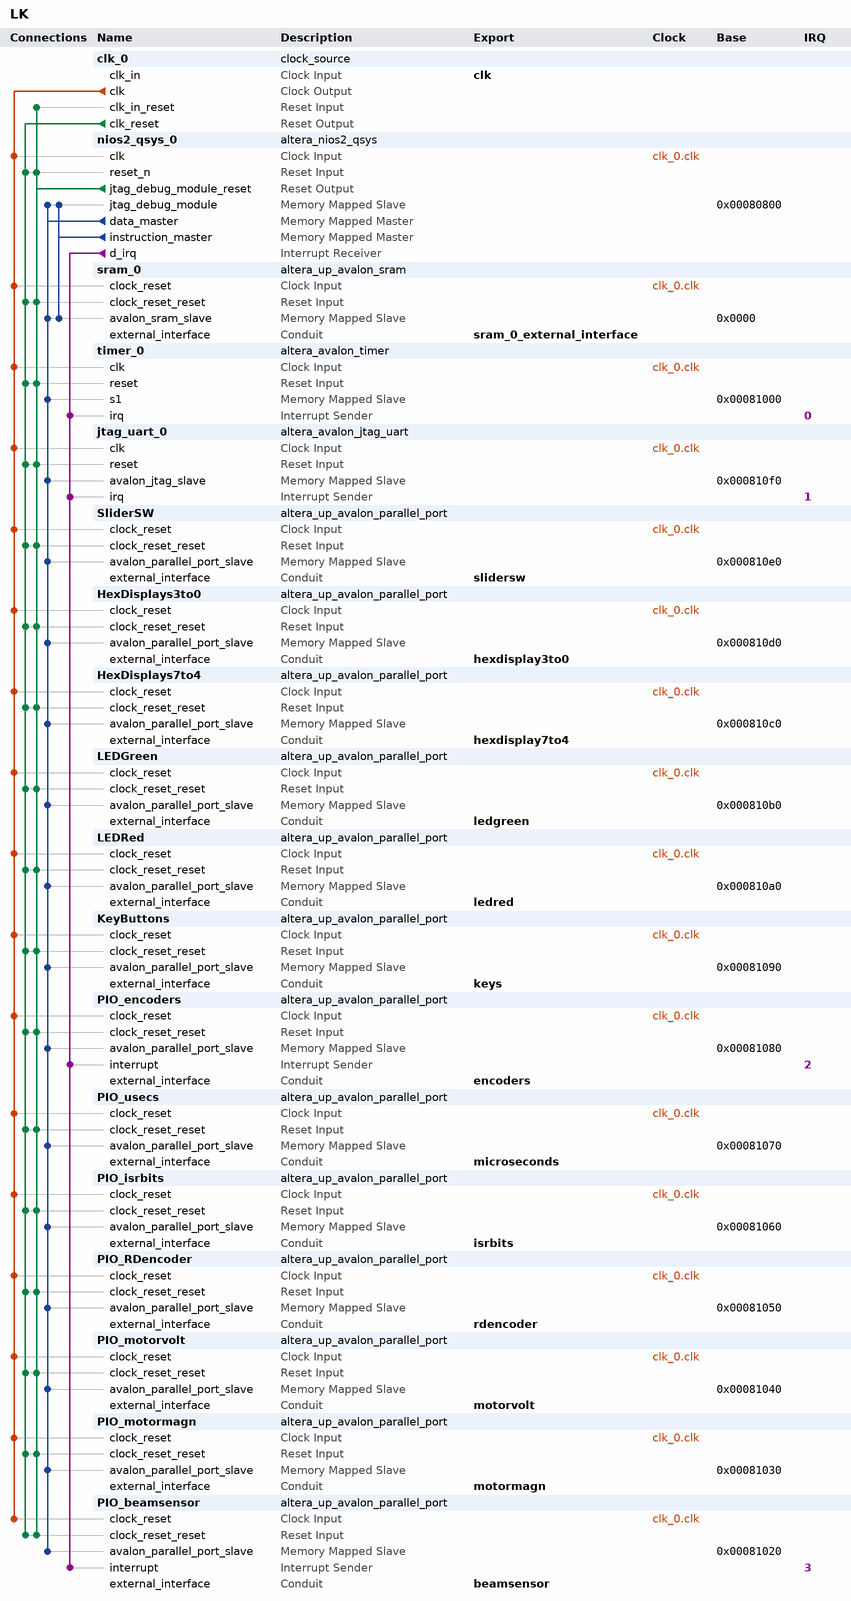
[diagram p0: system contents]
# Platform Designer (Qsys) system LK, Cyclone II EP2C35F672C6
# Parameters at their usual value, and those the tool derives, are not listed.
package require -exact qsys 13.0
create_system LK
set_project_property DEVICE_FAMILY {Cyclone II}
set_project_property DEVICE EP2C35F672C6

add_instance clk_0 clock_source 13.0
set_instance_parameter_value clk_0 clockFrequency 50000000

add_instance nios2_qsys_0 altera_nios2_qsys 13.0
set_instance_parameter_value nios2_qsys_0 resetSlave sram_0.avalon_sram_slave
set_instance_parameter_value nios2_qsys_0 mmu_TLBMissExcSlave None
set_instance_parameter_value nios2_qsys_0 exceptionSlave sram_0.avalon_sram_slave
set_instance_parameter_value nios2_qsys_0 breakSlave nios2_qsys_0.jtag_debug_module
set_instance_parameter_value nios2_qsys_0 impl Fast
set_instance_parameter_value nios2_qsys_0 icache_size 4096

add_instance sram_0 altera_up_avalon_sram 13.0
set_instance_parameter_value sram_0 board DE2
set_instance_parameter_value sram_0 pixel_buffer false

add_instance timer_0 altera_avalon_timer 13.0.1.99.2
set_instance_parameter_value timer_0 period 1
set_instance_parameter_value timer_0 periodUnits MSEC

add_instance jtag_uart_0 altera_avalon_jtag_uart 13.0.1.99.2
set_instance_parameter_value jtag_uart_0 simInteractiveOptions NO_INTERACTIVE_WINDOWS

add_instance SliderSW altera_up_avalon_parallel_port 13.0
set_instance_parameter_value SliderSW board DE2
set_instance_parameter_value SliderSW preset {Slider Switches}
set_instance_parameter_value SliderSW capture false
set_instance_parameter_value SliderSW edge Rising
set_instance_parameter_value SliderSW irq false

add_instance HexDisplays3to0 altera_up_avalon_parallel_port 13.0
set_instance_parameter_value HexDisplays3to0 board DE2
set_instance_parameter_value HexDisplays3to0 preset {Seven Segment Displays}
set_instance_parameter_value HexDisplays3to0 capture false
set_instance_parameter_value HexDisplays3to0 edge Rising
set_instance_parameter_value HexDisplays3to0 irq false

add_instance HexDisplays7to4 altera_up_avalon_parallel_port 13.0
set_instance_parameter_value HexDisplays7to4 board DE2
set_instance_parameter_value HexDisplays7to4 preset {Seven Segment Displays}
set_instance_parameter_value HexDisplays7to4 sevensegs {7 to 4}
set_instance_parameter_value HexDisplays7to4 capture false
set_instance_parameter_value HexDisplays7to4 edge Rising
set_instance_parameter_value HexDisplays7to4 irq false

add_instance LEDGreen altera_up_avalon_parallel_port 13.0
set_instance_parameter_value LEDGreen board DE2
set_instance_parameter_value LEDGreen preset LEDs
set_instance_parameter_value LEDGreen capture false
set_instance_parameter_value LEDGreen edge Rising
set_instance_parameter_value LEDGreen irq false

add_instance LEDRed altera_up_avalon_parallel_port 13.0
set_instance_parameter_value LEDRed board DE2
set_instance_parameter_value LEDRed preset LEDs
set_instance_parameter_value LEDRed leds Red
set_instance_parameter_value LEDRed capture false
set_instance_parameter_value LEDRed edge Rising
set_instance_parameter_value LEDRed irq false

add_instance KeyButtons altera_up_avalon_parallel_port 13.0
set_instance_parameter_value KeyButtons board DE2
set_instance_parameter_value KeyButtons preset Pushbuttons
set_instance_parameter_value KeyButtons capture false
set_instance_parameter_value KeyButtons edge Rising
set_instance_parameter_value KeyButtons irq false

add_instance PIO_encoders altera_up_avalon_parallel_port 13.0
set_instance_parameter_value PIO_encoders board DE2
set_instance_parameter_value PIO_encoders custom_port true
set_instance_parameter_value PIO_encoders preset Pushbuttons
set_instance_parameter_value PIO_encoders capture true
set_instance_parameter_value PIO_encoders edge Either
set_instance_parameter_value PIO_encoders irq true

add_instance PIO_usecs altera_up_avalon_parallel_port 13.0
set_instance_parameter_value PIO_usecs board DE2
set_instance_parameter_value PIO_usecs custom_port true
set_instance_parameter_value PIO_usecs preset Pushbuttons
set_instance_parameter_value PIO_usecs capture false
set_instance_parameter_value PIO_usecs edge Rising
set_instance_parameter_value PIO_usecs irq false

add_instance PIO_isrbits altera_up_avalon_parallel_port 13.0
set_instance_parameter_value PIO_isrbits board DE2
set_instance_parameter_value PIO_isrbits custom_port true
set_instance_parameter_value PIO_isrbits preset Pushbuttons
set_instance_parameter_value PIO_isrbits capture false
set_instance_parameter_value PIO_isrbits edge Rising
set_instance_parameter_value PIO_isrbits irq false

add_instance PIO_RDencoder altera_up_avalon_parallel_port 13.0
set_instance_parameter_value PIO_RDencoder board DE2
set_instance_parameter_value PIO_RDencoder custom_port true
set_instance_parameter_value PIO_RDencoder preset Pushbuttons
set_instance_parameter_value PIO_RDencoder capture false
set_instance_parameter_value PIO_RDencoder edge Rising
set_instance_parameter_value PIO_RDencoder irq false

add_instance PIO_motorvolt altera_up_avalon_parallel_port 13.0
set_instance_parameter_value PIO_motorvolt board DE2
set_instance_parameter_value PIO_motorvolt custom_port true
set_instance_parameter_value PIO_motorvolt preset Pushbuttons
set_instance_parameter_value PIO_motorvolt capture false
set_instance_parameter_value PIO_motorvolt edge Rising
set_instance_parameter_value PIO_motorvolt irq false

add_instance PIO_motormagn altera_up_avalon_parallel_port 13.0
set_instance_parameter_value PIO_motormagn board DE2
set_instance_parameter_value PIO_motormagn custom_port true
set_instance_parameter_value PIO_motormagn preset Pushbuttons
set_instance_parameter_value PIO_motormagn capture false
set_instance_parameter_value PIO_motormagn edge Rising
set_instance_parameter_value PIO_motormagn irq false

add_instance PIO_beamsensor altera_up_avalon_parallel_port 13.0
set_instance_parameter_value PIO_beamsensor board DE2
set_instance_parameter_value PIO_beamsensor custom_port true
set_instance_parameter_value PIO_beamsensor preset Pushbuttons
set_instance_parameter_value PIO_beamsensor capture true
set_instance_parameter_value PIO_beamsensor edge Either
set_instance_parameter_value PIO_beamsensor irq true

# connections
add_connection clk_0.clk HexDisplays3to0.clock_reset clock
add_connection clk_0.clk HexDisplays7to4.clock_reset clock
add_connection clk_0.clk jtag_uart_0.clk clock
add_connection clk_0.clk KeyButtons.clock_reset clock
add_connection clk_0.clk LEDGreen.clock_reset clock
add_connection clk_0.clk LEDRed.clock_reset clock
add_connection clk_0.clk nios2_qsys_0.clk clock
add_connection clk_0.clk PIO_beamsensor.clock_reset clock
add_connection clk_0.clk PIO_encoders.clock_reset clock
add_connection clk_0.clk PIO_isrbits.clock_reset clock
add_connection clk_0.clk PIO_motormagn.clock_reset clock
add_connection clk_0.clk PIO_motorvolt.clock_reset clock
add_connection clk_0.clk PIO_RDencoder.clock_reset clock
add_connection clk_0.clk PIO_usecs.clock_reset clock
add_connection clk_0.clk SliderSW.clock_reset clock
add_connection clk_0.clk sram_0.clock_reset clock
add_connection clk_0.clk timer_0.clk clock
add_connection clk_0.clk_reset HexDisplays3to0.clock_reset_reset reset
add_connection clk_0.clk_reset HexDisplays7to4.clock_reset_reset reset
add_connection clk_0.clk_reset jtag_uart_0.reset reset
add_connection clk_0.clk_reset KeyButtons.clock_reset_reset reset
add_connection clk_0.clk_reset LEDGreen.clock_reset_reset reset
add_connection clk_0.clk_reset LEDRed.clock_reset_reset reset
add_connection clk_0.clk_reset nios2_qsys_0.reset_n reset
add_connection clk_0.clk_reset PIO_beamsensor.clock_reset_reset reset
add_connection clk_0.clk_reset PIO_encoders.clock_reset_reset reset
add_connection clk_0.clk_reset PIO_isrbits.clock_reset_reset reset
add_connection clk_0.clk_reset PIO_motormagn.clock_reset_reset reset
add_connection clk_0.clk_reset PIO_motorvolt.clock_reset_reset reset
add_connection clk_0.clk_reset PIO_RDencoder.clock_reset_reset reset
add_connection clk_0.clk_reset PIO_usecs.clock_reset_reset reset
add_connection clk_0.clk_reset SliderSW.clock_reset_reset reset
add_connection clk_0.clk_reset sram_0.clock_reset_reset reset
add_connection clk_0.clk_reset timer_0.reset reset
add_connection nios2_qsys_0.jtag_debug_module_reset clk_0.clk_in_reset reset
add_connection nios2_qsys_0.jtag_debug_module_reset HexDisplays3to0.clock_reset_reset reset
add_connection nios2_qsys_0.jtag_debug_module_reset HexDisplays7to4.clock_reset_reset reset
add_connection nios2_qsys_0.jtag_debug_module_reset jtag_uart_0.reset reset
add_connection nios2_qsys_0.jtag_debug_module_reset KeyButtons.clock_reset_reset reset
add_connection nios2_qsys_0.jtag_debug_module_reset LEDGreen.clock_reset_reset reset
add_connection nios2_qsys_0.jtag_debug_module_reset LEDRed.clock_reset_reset reset
add_connection nios2_qsys_0.jtag_debug_module_reset nios2_qsys_0.reset_n reset
add_connection nios2_qsys_0.jtag_debug_module_reset PIO_beamsensor.clock_reset_reset reset
add_connection nios2_qsys_0.jtag_debug_module_reset PIO_encoders.clock_reset_reset reset
add_connection nios2_qsys_0.jtag_debug_module_reset PIO_isrbits.clock_reset_reset reset
add_connection nios2_qsys_0.jtag_debug_module_reset PIO_motormagn.clock_reset_reset reset
add_connection nios2_qsys_0.jtag_debug_module_reset PIO_motorvolt.clock_reset_reset reset
add_connection nios2_qsys_0.jtag_debug_module_reset PIO_RDencoder.clock_reset_reset reset
add_connection nios2_qsys_0.jtag_debug_module_reset PIO_usecs.clock_reset_reset reset
add_connection nios2_qsys_0.jtag_debug_module_reset SliderSW.clock_reset_reset reset
add_connection nios2_qsys_0.jtag_debug_module_reset sram_0.clock_reset_reset reset
add_connection nios2_qsys_0.jtag_debug_module_reset timer_0.reset reset
add_connection nios2_qsys_0.data_master HexDisplays3to0.avalon_parallel_port_slave avalon
set_connection_parameter_value nios2_qsys_0.data_master/HexDisplays3to0.avalon_parallel_port_slave baseAddress 0x000810d0
add_connection nios2_qsys_0.data_master HexDisplays7to4.avalon_parallel_port_slave avalon
set_connection_parameter_value nios2_qsys_0.data_master/HexDisplays7to4.avalon_parallel_port_slave baseAddress 0x000810c0
add_connection nios2_qsys_0.data_master jtag_uart_0.avalon_jtag_slave avalon
set_connection_parameter_value nios2_qsys_0.data_master/jtag_uart_0.avalon_jtag_slave baseAddress 0x000810f0
add_connection nios2_qsys_0.data_master KeyButtons.avalon_parallel_port_slave avalon
set_connection_parameter_value nios2_qsys_0.data_master/KeyButtons.avalon_parallel_port_slave baseAddress 0x00081090
add_connection nios2_qsys_0.data_master LEDGreen.avalon_parallel_port_slave avalon
set_connection_parameter_value nios2_qsys_0.data_master/LEDGreen.avalon_parallel_port_slave baseAddress 0x000810b0
add_connection nios2_qsys_0.data_master LEDRed.avalon_parallel_port_slave avalon
set_connection_parameter_value nios2_qsys_0.data_master/LEDRed.avalon_parallel_port_slave baseAddress 0x000810a0
add_connection nios2_qsys_0.data_master nios2_qsys_0.jtag_debug_module avalon
set_connection_parameter_value nios2_qsys_0.data_master/nios2_qsys_0.jtag_debug_module baseAddress 0x00080800
add_connection nios2_qsys_0.data_master PIO_beamsensor.avalon_parallel_port_slave avalon
set_connection_parameter_value nios2_qsys_0.data_master/PIO_beamsensor.avalon_parallel_port_slave baseAddress 0x00081020
add_connection nios2_qsys_0.data_master PIO_encoders.avalon_parallel_port_slave avalon
set_connection_parameter_value nios2_qsys_0.data_master/PIO_encoders.avalon_parallel_port_slave baseAddress 0x00081080
add_connection nios2_qsys_0.data_master PIO_isrbits.avalon_parallel_port_slave avalon
set_connection_parameter_value nios2_qsys_0.data_master/PIO_isrbits.avalon_parallel_port_slave baseAddress 0x00081060
add_connection nios2_qsys_0.data_master PIO_motormagn.avalon_parallel_port_slave avalon
set_connection_parameter_value nios2_qsys_0.data_master/PIO_motormagn.avalon_parallel_port_slave baseAddress 0x00081030
add_connection nios2_qsys_0.data_master PIO_motorvolt.avalon_parallel_port_slave avalon
set_connection_parameter_value nios2_qsys_0.data_master/PIO_motorvolt.avalon_parallel_port_slave baseAddress 0x00081040
add_connection nios2_qsys_0.data_master PIO_RDencoder.avalon_parallel_port_slave avalon
set_connection_parameter_value nios2_qsys_0.data_master/PIO_RDencoder.avalon_parallel_port_slave baseAddress 0x00081050
add_connection nios2_qsys_0.data_master PIO_usecs.avalon_parallel_port_slave avalon
set_connection_parameter_value nios2_qsys_0.data_master/PIO_usecs.avalon_parallel_port_slave baseAddress 0x00081070
add_connection nios2_qsys_0.data_master SliderSW.avalon_parallel_port_slave avalon
set_connection_parameter_value nios2_qsys_0.data_master/SliderSW.avalon_parallel_port_slave baseAddress 0x000810e0
add_connection nios2_qsys_0.data_master sram_0.avalon_sram_slave avalon
set_connection_parameter_value nios2_qsys_0.data_master/sram_0.avalon_sram_slave baseAddress 0x0000
add_connection nios2_qsys_0.data_master timer_0.s1 avalon
set_connection_parameter_value nios2_qsys_0.data_master/timer_0.s1 baseAddress 0x00081000
add_connection nios2_qsys_0.instruction_master nios2_qsys_0.jtag_debug_module avalon
set_connection_parameter_value nios2_qsys_0.instruction_master/nios2_qsys_0.jtag_debug_module baseAddress 0x00080800
add_connection nios2_qsys_0.instruction_master sram_0.avalon_sram_slave avalon
set_connection_parameter_value nios2_qsys_0.instruction_master/sram_0.avalon_sram_slave baseAddress 0x0000
add_connection nios2_qsys_0.d_irq jtag_uart_0.irq interrupt
set_connection_parameter_value nios2_qsys_0.d_irq/jtag_uart_0.irq irqNumber 1
add_connection nios2_qsys_0.d_irq PIO_beamsensor.interrupt interrupt
set_connection_parameter_value nios2_qsys_0.d_irq/PIO_beamsensor.interrupt irqNumber 3
add_connection nios2_qsys_0.d_irq PIO_encoders.interrupt interrupt
set_connection_parameter_value nios2_qsys_0.d_irq/PIO_encoders.interrupt irqNumber 2
add_connection nios2_qsys_0.d_irq timer_0.irq interrupt
set_connection_parameter_value nios2_qsys_0.d_irq/timer_0.irq irqNumber 0

# exported interfaces
add_interface clk clock sink
set_interface_property clk EXPORT_OF clk_0.clk_in
add_interface sram_0_external_interface conduit end
set_interface_property sram_0_external_interface EXPORT_OF sram_0.external_interface
add_interface slidersw conduit end
set_interface_property slidersw EXPORT_OF SliderSW.external_interface
add_interface hexdisplay3to0 conduit end
set_interface_property hexdisplay3to0 EXPORT_OF HexDisplays3to0.external_interface
add_interface hexdisplay7to4 conduit end
set_interface_property hexdisplay7to4 EXPORT_OF HexDisplays7to4.external_interface
add_interface ledgreen conduit end
set_interface_property ledgreen EXPORT_OF LEDGreen.external_interface
add_interface ledred conduit end
set_interface_property ledred EXPORT_OF LEDRed.external_interface
add_interface keys conduit end
set_interface_property keys EXPORT_OF KeyButtons.external_interface
add_interface encoders conduit end
set_interface_property encoders EXPORT_OF PIO_encoders.external_interface
add_interface microseconds conduit end
set_interface_property microseconds EXPORT_OF PIO_usecs.external_interface
add_interface isrbits conduit end
set_interface_property isrbits EXPORT_OF PIO_isrbits.external_interface
add_interface rdencoder conduit end
set_interface_property rdencoder EXPORT_OF PIO_RDencoder.external_interface
add_interface motorvolt conduit end
set_interface_property motorvolt EXPORT_OF PIO_motorvolt.external_interface
add_interface motormagn conduit end
set_interface_property motormagn EXPORT_OF PIO_motormagn.external_interface
add_interface beamsensor conduit end
set_interface_property beamsensor EXPORT_OF PIO_beamsensor.external_interface

set_interconnect_requirement {$system} qsys_mm.clockCrossingAdapter HANDSHAKE
set_interconnect_requirement {$system} qsys_mm.maxAdditionalLatency 1

save_system LK.qsys
